# Altium schematic sheet core.SchDoc
size A3
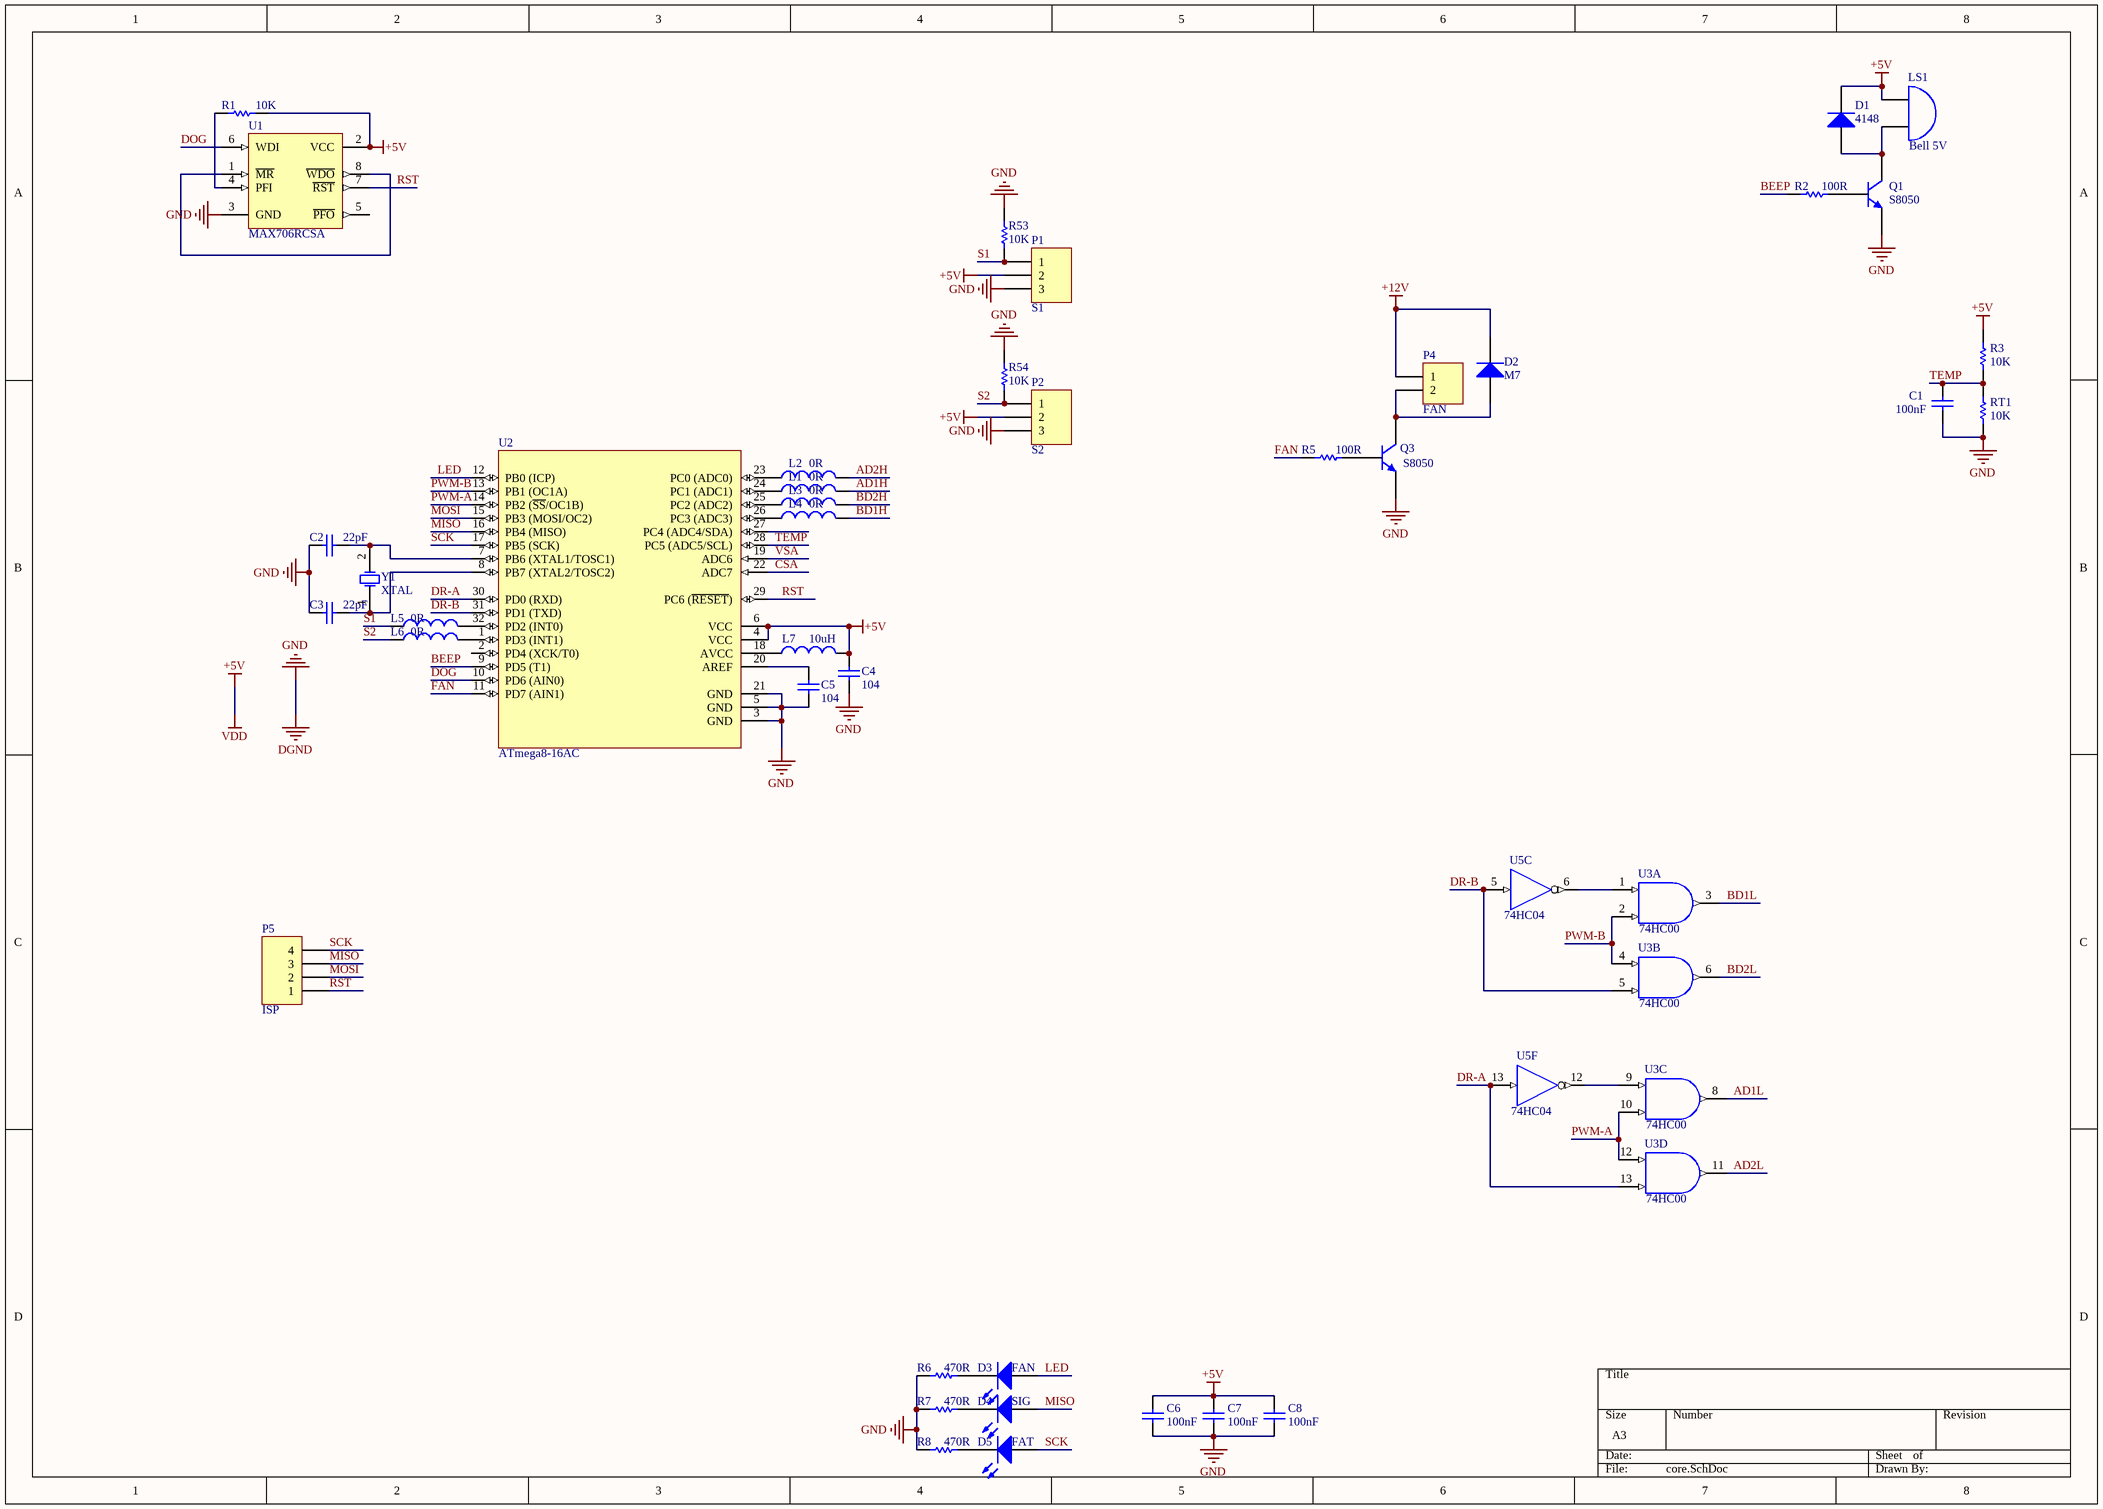
[diagram p0: core.SchDoc]

## Parts
C1  value 100nF  [0603]  (hidden comment: Cap)
C2  value 22pF  [0603]  (hidden comment: Cap)
C3  value 22pF  [0603]  (hidden comment: Cap)
C4  value 104  [0603]  (hidden comment: Cap)
C5  value 104  [0603]  (hidden comment: Cap)
C6  value 100nF  [0603]  (hidden comment: Cap)
C7  value 100nF  [0603]  (hidden comment: Cap)
C8  value 100nF  [0603]  (hidden comment: Cap)
D1  4148  [LL34]
D2  value M7  [SMA]  (hidden comment: Diode)
D3  FAN  [0603-LED]
D4  SIG  [0603-LED]
D5  FAT  [0603-LED]
L1  value 0R  [0603]  (hidden comment: Inductor)
L2  value 0R  [0603]  (hidden comment: Inductor)
L3  value 0R  [0603]  (hidden comment: Inductor)
L4  value 0R  [0603]  (hidden comment: Inductor)
L5  value 0R  [0603]  (hidden comment: Inductor)
L6  value 0R  [0603]  (hidden comment: Inductor)
L7  value 10uH  [0603]  (hidden comment: Inductor)
LS1  value Bell 5V  [BEEP-9x5.5]  (hidden comment: Bell)
P1  S1  [HDR1X3]
P2  S2  [HDR1X3]
P4  FAN  [XH2.54-2P]
P5  ISP  [HDR1X4]
Q1  value S8050  [SOT-23-NPN]  (hidden comment: NPN)
Q3  value S8050  [SOT-23-NPN]  (hidden comment: NPN)
R1  value 10K  [0603]  (hidden comment: Res1)
R2  value 100R  [0603]  (hidden comment: Res1)
R3  value 10K  [0603]  (hidden comment: Res1)
R5  value 100R  [0603]  (hidden comment: Res1)
R6  value 470R  [0603]  (hidden comment: Res1)
R7  value 470R  [0603]  (hidden comment: Res1)
R8  value 470R  [0603]  (hidden comment: Res1)
R53  value 10K  [0603]  (hidden comment: Res1)
R54  value 10K  [0603]  (hidden comment: Res1)
RT1  value 10K  [RT-2.0]  (hidden comment: Res1)
U1  MAX706RCSA  [SOIC8]
U2  ATmega8-16AC  [32A_M]
U3  value 74HC00  [751A]  (hidden comment: IC)  (parts A,B,C,D of 4)
U5  value 74HC04  [751A]  (hidden comment: IC)  (parts C,F of 6)
Y1  XTAL  [49SD]

## Nets
+5V: C4.1 C6.2 C7.2 C8.2 D1.2(K) L7.2 LS1.1(A) P1.2 P2.2 R1.2 R3.2 U1.2(VCC) U2.4(VCC) U2.6(VCC) U3.14(VDD) U5.14(VDD)  [also labelled VDD]
+12V: D2.2(K) P4.1
DGND: C1.1 C2.2 C3.2 C4.2 C5.2 C6.1 C7.1 C8.1 P1.3 P2.3 Q1.1(E) Q3.1(E) R6.2 R7.2 R8.2 R53.2 R54.2 RT1.1 U1.3(GND) U2.3(GND) U2.5(GND) U2.21(GND) U3.7(GND) U5.7(GND)  [also labelled GND]
AD1H: L1.2
AD1L: U3.8(Y)
AD2H: L2.2
AD2L: U3.11(Y)
BD1H: L4.2
BD1L: U3.3(Y)
BD2H: L3.2
BD2L: U3.6(Y)
BEEP: R2.2 U2.9(PD5_(T1))
CSA: U2.22(ADC7)
DOG: U1.6(WDI) U2.10(PD6_(AIN0))
DR-A: U2.30(PD0_(RXD)) U3.13(B) U5.13(A)
DR-B: U2.31(PD1_(TXD)) U3.5(B) U5.5(A)
FAN: R5.1 U2.11(PD7_(AIN1))
LED: D3.1(A) U2.12(PB0_(ICP))
MISO: D4.1(A) P5.3 U2.16(PB4_(MISO))
MOSI: P5.2 U2.15(PB3_(MOSI/OC2))
PWM-A: U2.14(PB2_(~{SS}/OC1B)) U3.10(B) U3.12(A)
PWM-B: U2.13(PB1_(OC1A)) U3.2(B) U3.4(A)
RST: P5.1 U1.7(~{RST}) U2.29(PC6_(~{RESET}))
S1: L5.1 P1.1 R53.1
S2: L6.1 P2.1 R54.1
SCK: D5.1(A) P5.4 U2.17(PB5_(SCK))
TEMP: C1.2 R3.1 RT1.2 U2.28(PC5_(ADC5/SCL))
VSA: U2.19(ADC6)
NetC2_1: C2.1 U2.7(PB6_(XTAL1/TOSC1)) Y1.2(OSC2)
NetC3_1: C3.1 U2.8(PB7_(XTAL2/TOSC2)) Y1.1(OSC1)
NetC5_1: C5.1 U2.20(AREF)
NetD1_1: D1.1(A) LS1.2(B) Q1.3(C)
NetD2_1: D2.1(A) P4.2 Q3.3(C)
NetD3_2: D3.2(K) R6.1
NetD4_2: D4.2(K) R7.1
NetD5_2: D5.2(K) R8.1
NetL1_1: L1.1 U2.24(PC1_(ADC1))
NetL2_1: L2.1 U2.23(PC0_(ADC0))
NetL3_1: L3.1 U2.25(PC2_(ADC2))
NetL4_1: L4.1 U2.26(PC3_(ADC3))
NetL5_2: L5.2 U2.32(PD2_(INT0))
NetL6_2: L6.2 U2.1(PD3_(INT1))
NetL7_1: L7.1 U2.18(AVCC)
NetQ1_2: Q1.2(B) R2.1
NetQ3_2: Q3.2(B) R5.2
NetR1_1: R1.1 U1.4(PFI)
NetU1_1: U1.1(~{MR}) U1.8(~{WDO})
NetU3_1: U3.1(A) U5.6(Y)
NetU3_9: U3.9(A) U5.12(Y)

Not connected (* = marked no-connect by the designer): U1 5(~{PFO}); U2 2(PD4_(XCK/T0)) 27(PC4_(ADC4/SDA))

## Library data of the parts
C1-C8 = Cap: Capacitor; Published: 8-Jun-2000; LatestRevisionDate: 17-Jul-2002; LatestRevisionNote: Re-released for DXP Platform.; PackageReference: RAD-0.3; Publisher: Altium Limited
D1 = Diode 1N5408: 3 Amp Medium Power Silicon Rectifier Diode; Value: 1N4148; Published: 8-Jun-2000; LatestRevisionDate: 17-Jul-2002; LatestRevisionNote: Re-released for DXP Platform.; DatasheetDocument: Aug-1984; PackageReference: DO-201AD; Publisher: Altium Limited; ComponentLink1Description: Manufacturer Link; ComponentLink1URL: http://www.irf.com/
D2 = Diode 1N4007: 1 Amp General Purpose Rectifier; Published: 8-Jun-2000; LatestRevisionDate: 17-Jul-2002; LatestRevisionNote: Re-released for DXP Platform.; DatasheetDocument: 1998; PackageDocument: Aug-1999; PackageReference: DO-41; Publisher: Altium Limited; Code_JEDEC: DO-204-AL; ComponentLink1Description: Manufacturer Link; ComponentLink1URL: http://www.fairchildsemi.com/; ComponentLink2Description: Datasheet; ComponentLink2URL: http://www.fairchildsemi.com/ds/1N%2F1N4001.pdf
D3-D5 = LED2: Typical RED, GREEN, YELLOW, AMBER GaAs LED; Published: 8-Jun-2000; LatestRevisionDate: 17-Jul-2002; LatestRevisionNote: Re-released for DXP Platform.; PackageDocument: Feb-2002; PackageReference: 3.2X1.6X1.1; Publisher: Altium Limited; Value: RED
L1-L7 = Inductor: Code_IEC: 1005; Published: 8-Jun-2000; LatestRevisionDate: 17-Jul-2002; LatestRevisionNote: Re-released for DXP Platform.; PackageReference: 0402-A; Publisher: Altium Limited; Code_JEITA: 0402
LS1 = Bell: Electrical Bell; pin to pad: 1>2 2>1; Published: 24-Mar-1999; LatestRevisionDate: 17-Jul-2002; LatestRevisionNote: Re-released for DXP Platform.; PackageReference: PIN2; Publisher: Altium Limited
P1 P2 = Header 3: Header, 3-Pin; LatestRevisionDate: 17-Jul-2002; LatestRevisionNote: Re-released for DXP Platform.; Publisher: Altium Limited
P4 = Header 2: Header, 2-Pin; Value: XH2.54-2P; LatestRevisionDate: 17-Jul-2002; LatestRevisionNote: Re-released for DXP Platform.; Publisher: Altium Limited
P5 = Header 4: Header, 4-Pin; LatestRevisionDate: 17-Jul-2002; LatestRevisionNote: Re-released for DXP Platform.; Publisher: Altium Limited
Q1 Q3 = 2N5551: NPN General Purpose Amplifier; Published: 8-Jun-2000; LatestRevisionDate: 17-Jan-2003; LatestRevisionNote: PCB Footprint 'BCY-W3/D4.7' replaced; DatasheetDocument: 1997; PackageDocument: Sep-1998; PackageReference: TO-92A; Publisher: Altium Limited; ComponentLink1Description: Manufacturer Link; ComponentLink1URL: http://www.fairchildsemi.com/; ComponentLink2Description: Datasheet; ComponentLink2URL: http://www.fairchildsemi.com/ds/2N%2F2N5551.pdf
R1-R3 R5-R8 R53 R54 RT1 = Res1: Resistor; Published: 8-Jun-2000; LatestRevisionDate: 17-Jul-2002; LatestRevisionNote: Re-released for DXP Platform.; PackageReference: AXIAL-0.3; Publisher: Altium Limited
U1 = MAX706RCSA: +3V Voltage Monitoring, Low-Cost, µP Supervisory Circuit; Published: 16-Jan-2001; LatestRevisionDate: 13-Apr-2006; LatestRevisionNote: IPC-7351 Footprint Added.; DatasheetVersion: Sep-1995; PackageReference: NSO8; Publisher: Altium Limited; PackageDescription: 8-Pin Small Outline Integrated Circuit 1.27 mm Pitch; Code_JEDEC: MS-012-AA; Code_IPC: SOIC127P600-8; ComponentLink1Description: Manufacturer Link; ComponentLink1URL: http://www.maxim-ic.com/; ComponentLink2Description: Datasheet; ComponentLink2URL: http://pdfserv.maxim-ic.com/en/ds/MAX706P-MAX708T.pdf
U2 = ATmega8-16AC: 8-Bit AVR Microcontroller with 8K Bytes of In-System Programmable Flash Memory; Published: 17-Sep-2003; LatestRevisionDate: 13-Apr-2006; LatestRevisionNote: IPC-7351 Footprint Added.; DatasheetVersion: 2486H-AVR-09/02; PackageVersion: revB, Oct-2001; PackageReference: 32A; Publisher: Altium Limited; PackageDescription: 32-Pin Thin Quad Flat Pack 0.8 mm Pitch; Code_JEDEC: MS-026-ABA; ComponentLink1Description: Manufacturer Link; ComponentLink1URL: http://www.atmel.com; ComponentLink2Description: Datasheet; ComponentLink2URL: http://www.atmel.com/dyn/resources/prod_documents/doc2486.pdf
U3 = MC74HC08AD: Quad 2-Input AND Gate; Published: 17-Jul-2002; LatestRevisionDate: 13-Apr-2006; LatestRevisionNote: IPC-7351 Footprint Added.; DatasheetVersion: 1989; PackageVersion: 1991; PackageReference: 751A-02; Publisher: Altium Limited; PackageDescription: 14-Pin Small Outline Integrated Circuit 1.27 mm Pitch; Code_IPC: SOIC127P600-14; ComponentLink1Description: Manufacturer Link; ComponentLink1URL: http://www.onsemi.com/site/products/parametrics/0,4446,247,00.html; ComponentLink2Description: Ibis Model; ComponentLink2URL: http://www.onsemi.com/pub/Collateral/MC54HC08AJ.IBS
U5 = MC74HC04AD: Hex Inverter; Published: 17-Jul-2002; LatestRevisionDate: 13-Apr-2006; LatestRevisionNote: IPC-7351 Footprint Added.; DatasheetVersion: 1989; PackageVersion: 1991; PackageReference: 751A-02; Publisher: Altium Limited; PackageDescription: 14-Pin Small Outline Integrated Circuit 1.27 mm Pitch; Code_IPC: SOIC127P600-14; ComponentLink1Description: Manufacturer Link; ComponentLink1URL: http://www.onsemi.com/site/products/parametrics/0,4446,247,00.html; ComponentLink2Description: Ibis Model; ComponentLink2URL: http://www.onsemi.com/pub/Collateral/MC54HC04AJ.IBS
Y1 = XTAL: Crystal Oscillator; Published: 8-Jun-2000; LatestRevisionDate: 17-Jul-2002; LatestRevisionNote: Re-released for DXP Platform.; PackageReference: R38; Publisher: Altium Limited